# Altium schematic sheet 12-Flow meter.SchDoc
size A4
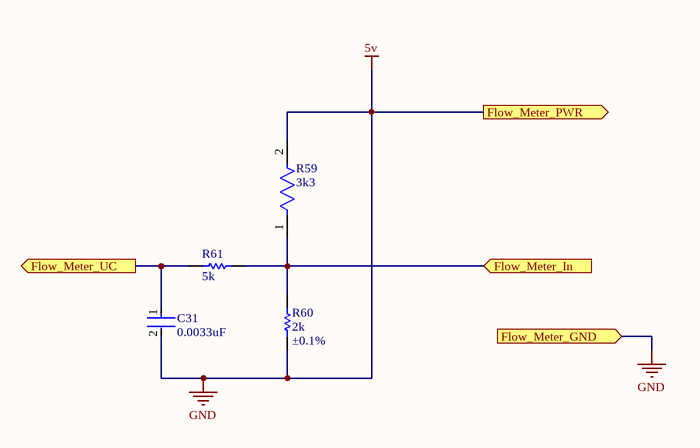
[diagram p0: 12-Flow meter.SchDoc]

## Parts
C31  0.0033uF  [FP-GRM188-0_1-e0_2_0_5-IPC_A]
R59  3k3  [FP-RC0603-0_55-MFG]
R60  value 2k  Tolerance: ±0.1%  [1608[0603]]  (hidden comment: Res1)
R61  value 5k  [1608[0603]]  (hidden comment: Res1)

## Ports
Flow_Meter_GND (in), Flow_Meter_In (in), Flow_Meter_PWR (out), Flow_Meter_UC (out)

## Nets
5v: C31.2 R59.2 R60.1 ; port Flow_Meter_PWR, port Flow_Meter_GND  [also labelled GND]
Flow_Meter_In: R59.1 R60.2 R61.1 ; port Flow_Meter_In
Flow_Meter_UC: C31.1 R61.2 ; port Flow_Meter_UC

## Library data of the parts
C31 = CMP-2006-02467-2: Chip Multilayer Ceramic Capacitors for General Purpose, 0603, 3300pF, C0G, 30ppm/°C, 5%, 50V; Capacitance: 3.3nF; Max Operating Temperature: 125°C; Voltage Rating (DC): 50V; Termination: SMD/SMT; Packaging: Tape and Reel; Tolerance: 5%; Lead Free: Lead Free; Width: 0.031inch; Thickness: 0.035inch; REACH SVHC: No SVHC; Dielectric: C0G; Min Operating Temperature: -55°C; Material: Ceramic; Voltage Rating: 50V; Case/Package: 0603; Length: 1.6mm; Voltage: 50V; Case Code (Imperial): 0603; Radiation Hardening: No; Case Code (Metric): 1608; Mount: Surface Mount; Height: 0.8mm; Package Quantity: 4000; Depth: 0.8mm
R59 = CMP-1012-00567-3: NexarPartId: 40011875; Tolerance: 1%; Power Rating: 100mW; Temperature Coefficient: 100ppm/°C; Voltage Rating (DC): 50V; Resistance: 3.3kΩ; Military Standard: Not; Case/Package: 0603; Mount: Surface Mount; Lead Free: Lead Free; Packaging: Tape & Reel; Termination: SMD/SMT; Number of Terminations: 2; Composition: Thick Film; Length: 1.6mm; Max Power Dissipation: 100mW; Width: 800µm; Features: Moisture Resistant; Max Operating Temperature: 155°C; Depth: 800µm; Number of Pins: 2; REACH SVHC: No SVHC; Case Code (Imperial): 0603; Case Code (Metric): 0603; RoHS: Compliant; Voltage Rating (AC): 50V; Voltage Rating: 50V; Schedule B: 8533210045, 8533210045; Min Operating Temperature: -55°C; Height: 450µm
R60 = Res1: Resistor; Manufacturer: Yageo; Manufacturer Part Number: AT0603BRD072KL; Power (Watts): 0.1W, 1/10W; Temperature Coefficient: ±25ppm/°C; Supplier 1: Digi-Key; Supplier Part Number 1: YAG2112CT-ND; RoHS: RoHS Compliant; Category: Resistors; Stock 1: 1218; Pricing 1: 1=0.59, 10=0.431, 25=0.3188, 50=0.235, 100=0.1725, 250=0.14248, 500=0.11746, 1000=0.08498 (CAD); Packaging: Cut Tape (CT); Part Status: Active; Resistance (Ohms): 2k; Composition: Thin Film; Features: Anti-Sulfur, Automotive AEC-Q200, Moisture Resistant; Operating Temperature: -55°C ~ 155°C; Package / Case: 0603 (1608 Metric); Supplier Device Package: 0603; Size / Dimension: 0.063" L x 0.032" W (1.60mm x 0.80mm); Height - Seated (Max): 0.022" (0.55mm); Number of Terminations: 2; Failure Rate: -; ComponentLink1URL: http://www.yageo.com/documents/recent/PYu-AT_51_RoHS_L-3.pdf; ComponentLink1Description: http://www.yageo.com/documents/recent/PYu-AT_51_RoHS_L-3.pdf
R61 = Res1: Resistor; Manufacturer: Yageo; Manufacturer Part Number: AT0603BRD072KL; Resistance (Ohms): 2k; Power (Watts): 0.1W, 1/10W; Temperature Coefficient: ±25ppm/°C; Supplier 1: Digi-Key; Supplier Part Number 1: YAG2112CT-ND; RoHS: RoHS Compliant; Category: Resistors; Stock 1: 1218; Pricing 1: 1=0.59, 10=0.431, 25=0.3188, 50=0.235, 100=0.1725, 250=0.14248, 500=0.11746, 1000=0.08498 (CAD); Packaging: Cut Tape (CT); Part Status: Active; Composition: Thin Film; Features: Anti-Sulfur, Automotive AEC-Q200, Moisture Resistant; Operating Temperature: -55°C ~ 155°C; Package / Case: 0603 (1608 Metric); Supplier Device Package: 0603; Size / Dimension: 0.063" L x 0.032" W (1.60mm x 0.80mm); Height - Seated (Max): 0.022" (0.55mm); Number of Terminations: 2; Failure Rate: -; ComponentLink1URL: http://www.yageo.com/documents/recent/PYu-AT_51_RoHS_L-3.pdf; ComponentLink1Description: http://www.yageo.com/documents/recent/PYu-AT_51_RoHS_L-3.pdf